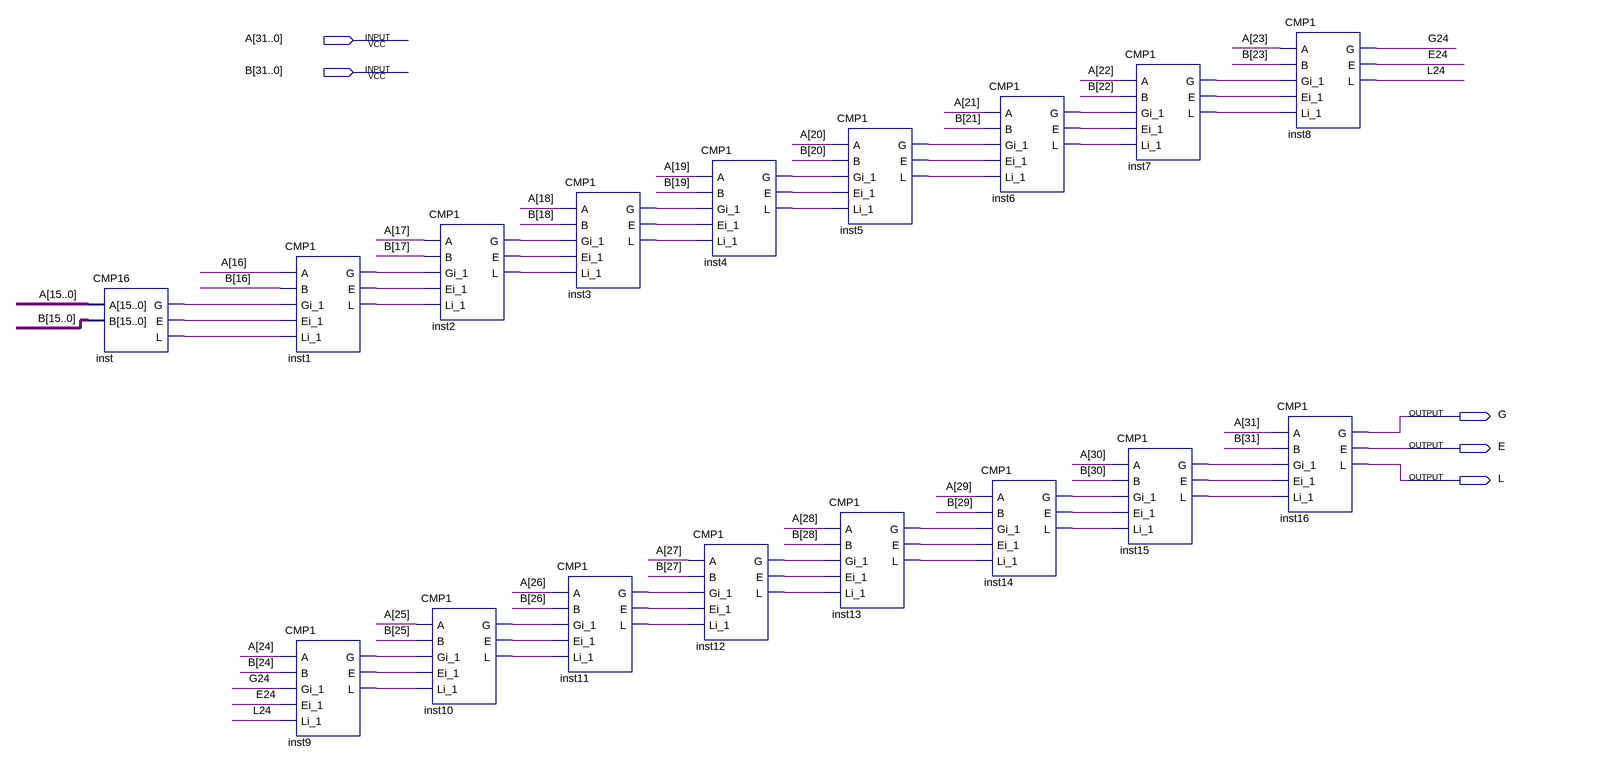
[diagram p0: schematic sheet]
// Quartus schematic CMP32.bdf as structural Verilog: 17 symbols, 5 pins
module CMP32 (
  input  [31:0] A,
  input  [31:0] B,
  output G,
  output E,
  output L
);

  wire E24, G24, inst1_e, inst1_g, inst1_l, inst2_e, inst2_g, inst2_l, inst3_e, inst3_g, inst3_l, inst4_e,
       inst4_g, inst4_l, inst5_e, inst5_g, inst5_l, inst6_e, inst6_g, inst6_l, inst7_e, inst7_g, inst7_l,
       inst9_e, inst9_g, inst9_l, inst10_e, inst10_g, inst10_l, inst11_e, inst11_g, inst11_l, inst12_e,
       inst12_g, inst12_l, inst13_e, inst13_g, inst13_l, inst14_e, inst14_g, inst14_l, inst15_e, inst15_g,
       inst15_l, inst_e, inst_g, inst_l, L24;

  CMP16 inst (.A(A[15:0]), .B(B[15:0]), .G(inst_g), .E(inst_e), .L(inst_l));
  CMP1 inst1 (.A(A[16]), .B(B[16]), .Gi_1(inst_g), .Ei_1(inst_e), .Li_1(inst_l), .G(inst1_g), .E(inst1_e), .L(inst1_l));
  CMP1 inst9 (.A(A[24]), .B(B[24]), .Gi_1(G24), .Ei_1(E24), .Li_1(L24), .G(inst9_g), .E(inst9_e), .L(inst9_l));
  CMP1 inst2 (
    .A(A[17]), .B(B[17]), .Gi_1(inst1_g), .Ei_1(inst1_e), .Li_1(inst1_l), .G(inst2_g), .E(inst2_e),
    .L(inst2_l));
  CMP1 inst10 (
    .A(A[25]), .B(B[25]), .Gi_1(inst9_g), .Ei_1(inst9_e), .Li_1(inst9_l), .G(inst10_g), .E(inst10_e),
    .L(inst10_l));
  CMP1 inst3 (
    .A(A[18]), .B(B[18]), .Gi_1(inst2_g), .Ei_1(inst2_e), .Li_1(inst2_l), .G(inst3_g), .E(inst3_e),
    .L(inst3_l));
  CMP1 inst11 (
    .A(A[26]), .B(B[26]), .Gi_1(inst10_g), .Ei_1(inst10_e), .Li_1(inst10_l), .G(inst11_g), .E(inst11_e),
    .L(inst11_l));
  CMP1 inst12 (
    .A(A[27]), .B(B[27]), .Gi_1(inst11_g), .Ei_1(inst11_e), .Li_1(inst11_l), .G(inst12_g), .E(inst12_e),
    .L(inst12_l));
  CMP1 inst4 (
    .A(A[19]), .B(B[19]), .Gi_1(inst3_g), .Ei_1(inst3_e), .Li_1(inst3_l), .G(inst4_g), .E(inst4_e),
    .L(inst4_l));
  CMP1 inst5 (
    .A(A[20]), .B(B[20]), .Gi_1(inst4_g), .Ei_1(inst4_e), .Li_1(inst4_l), .G(inst5_g), .E(inst5_e),
    .L(inst5_l));
  CMP1 inst13 (
    .A(A[28]), .B(B[28]), .Gi_1(inst12_g), .Ei_1(inst12_e), .Li_1(inst12_l), .G(inst13_g), .E(inst13_e),
    .L(inst13_l));
  CMP1 inst6 (
    .A(A[21]), .B(B[21]), .Gi_1(inst5_g), .Ei_1(inst5_e), .Li_1(inst5_l), .G(inst6_g), .E(inst6_e),
    .L(inst6_l));
  CMP1 inst14 (
    .A(A[29]), .B(B[29]), .Gi_1(inst13_g), .Ei_1(inst13_e), .Li_1(inst13_l), .G(inst14_g), .E(inst14_e),
    .L(inst14_l));
  CMP1 inst7 (
    .A(A[22]), .B(B[22]), .Gi_1(inst6_g), .Ei_1(inst6_e), .Li_1(inst6_l), .G(inst7_g), .E(inst7_e),
    .L(inst7_l));
  CMP1 inst15 (
    .A(A[30]), .B(B[30]), .Gi_1(inst14_g), .Ei_1(inst14_e), .Li_1(inst14_l), .G(inst15_g), .E(inst15_e),
    .L(inst15_l));
  CMP1 inst8 (.A(A[23]), .B(B[23]), .Gi_1(inst7_g), .Ei_1(inst7_e), .Li_1(inst7_l), .G(G24), .E(E24), .L(L24));
  CMP1 inst16 (.A(A[31]), .B(B[31]), .Gi_1(inst15_g), .Ei_1(inst15_e), .Li_1(inst15_l), .G(G), .E(E), .L(L));
endmodule
